# EAGLE schematic LPC1114 -- Valdez Mutant v.03 (EAGLE 7.0.0)
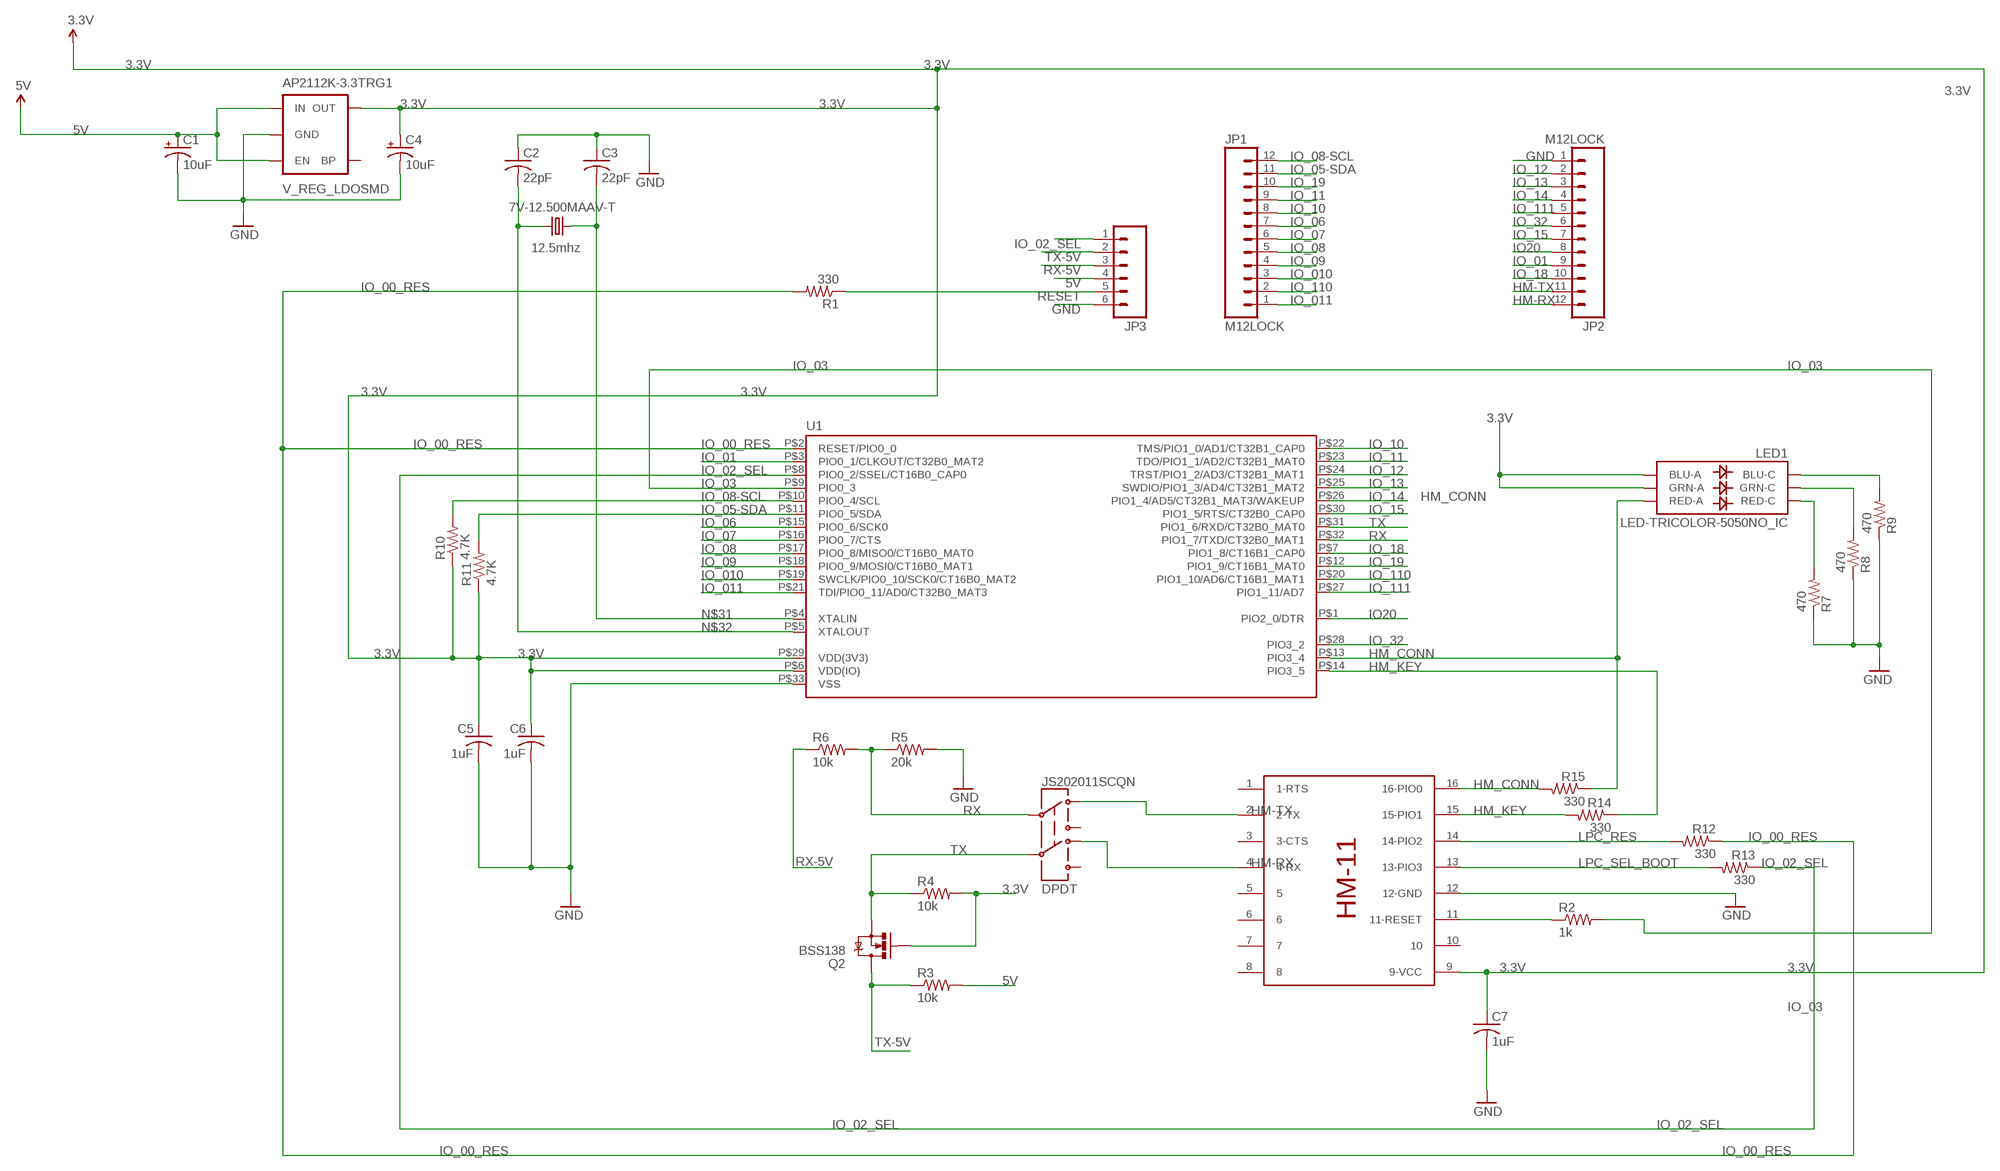
[diagram p0: schematic, sheet 1]

## Parts
7V-12.500MAAV-T  12.5mhz  CRYSTAL5X3  [CRYSTAL-SMD-5X3]
AP2112K-3.3TRG1  V_REG_LDOSMD  [SOT23-5]
C1  10uF  CAP_POL1206  [EIA3216]
C2  22pF  C-USC0402K  [C0402K]
C3  22pF  C-USC0402K  [C0402K]
C4  10uF  CAP_POL1206  [EIA3216]
C5  1uF  C-USC0402K  [C0402K]
C6  1uF  C-USC0402K  [C0402K]
C7  1uF  C-USC0402K  [C0402K]
JP1  M12LOCK  [1X12_LOCK]
JP2  M12LOCK  [1X12_LOCK]
JP3  M06LOCK  [1X06_LOCK]
JS202011SCQN  DPDT  SWITCH-DPDTAYZ0202  [AYZ0202]
LED1  LED-TRICOLOR-5050NO_IC  [LED-TRICOLOR-5050]
Q2  BSS138  MOSFET-NCHANNELBSS138  [SOT23]
R1  330  R-US_R0402  [R0402]
R2  1k  R-US_R0402  [R0402]
R3  10k  R-US_R0402  [R0402]
R4  10k  R-US_R0402  [R0402]
R5  20k  R-US_R0402  [R0402]
R6  10k  R-US_R0402  [R0402]
R7  470  R-US_R0402  [R0402]
R8  470  R-US_R0402  [R0402]
R9  470  R-US_R0402  [R0402]
R10  4.7K  R-US_R0402  [R0402]
R11  4.7K  R-US_R0402  [R0402]
R12  330  R-US_R0402  [R0402]
R13  330  R-US_R0402  [R0402]
R14  330  R-US_R0402  [R0402]
R15  330  R-US_R0402  [R0402]
U1  LPC1113/4_QFN  [HVQFN33-7X7]
U$1  HM-11  [HM-11]

## Nets
3.3V: AP2112K-3.3TRG1.5(OUT) C4.A(+) C5.1 C6.1 C7.1 LED1.1(GRN-A) LED1.3(BLU-A) Q2.1(G) R4.2 R10.1 R11.1 U1.P$6(VDD(IO)) U1.P$29(VDD(3V3)) U$1.9(9-VCC)
5V: AP2112K-3.3TRG1.1(IN) AP2112K-3.3TRG1.3(EN) C1.A(+) JP3.4 R3.2
CONN: R15.2 U$1.16(16-PIO0)
GND: AP2112K-3.3TRG1.2(GND) C1.C(-) C2.1 C3.1 C4.C(-) C5.2 C6.2 C7.2 JP2.1 JP3.6 R5.2 R7.1 R8.1 R9.1 U1.P$33(VSS) U$1.12(12-GND)
HM-RX: JP2.12 JS202011SCQN.4 U$1.4(4-RX)
HM-TX: JP2.11 JS202011SCQN.1 U$1.2(2-TX)
HM_CONN: LED1.2(RED-A) R15.1 U1.P$13(PIO3_4)
HM_KEY: R14.1 U1.P$14(PIO3_5)
IO20: JP2.8 U1.P$1(PIO2_0/DTR)
IO_00_RES: R1.2 R12.1 U1.P$2(RESET/PIO0_0)
IO_01: JP2.9 U1.P$3(PIO0_1/CLKOUT/CT32B0_MAT2)
IO_02_SEL: JP3.1 R13.1 U1.P$8(PIO0_2/SSEL/CT16B0_CAP0)
IO_03: R2.2 U1.P$9(PIO0_3)
IO_05-SDA: JP1.11 R11.2 U1.P$11(PIO0_5/SDA)
IO_06: JP1.7 U1.P$15(PIO0_6/SCK0)
IO_07: JP1.6 U1.P$16(PIO0_7/CTS)
IO_08: JP1.5 U1.P$17(PIO0_8/MISO0/CT16B0_MAT0)
IO_08-SCL: JP1.12 R10.2 U1.P$10(PIO0_4/SCL)
IO_09: JP1.4 U1.P$18(PIO0_9/MOSI0/CT16B0_MAT1)
IO_10: JP1.8 U1.P$22(TMS/PIO1_0/AD1/CT32B1_CAP0)
IO_010: JP1.3 U1.P$19(SWCLK/PIO0_10/SCK0/CT16B0_MAT2)
IO_11: JP1.9 U1.P$23(TDO/PIO1_1/AD2/CT32B1_MAT0)
IO_011: JP1.1 U1.P$21(TDI/PIO0_11/AD0/CT32B0_MAT3)
IO_12: JP2.2 U1.P$24(TRST/PIO1_2/AD3/CT32B1_MAT1)
IO_13: JP2.3 U1.P$25(SWDIO/PIO1_3/AD4/CT32B1_MAT2)
IO_14: JP2.4 U1.P$26(PIO1_4/AD5/CT32B1_MAT3/WAKEUP)
IO_15: JP2.7 U1.P$30(PIO1_5/RTS/CT32B0_CAP0)
IO_18: JP2.10 U1.P$7(PIO1_8/CT16B1_CAP0)
IO_19: JP1.10 U1.P$12(PIO1_9/CT16B1_MAT0)
IO_32: JP2.6 U1.P$28(PIO3_2)
IO_110: JP1.2 U1.P$20(PIO1_10/AD6/CT16B1_MAT1)
IO_111: JP2.5 U1.P$27(PIO1_11/AD7)
KEY: R14.2 U$1.15(15-PIO1)
LPC_RES: R12.2 U$1.14(14-PIO2)
LPC_SEL_BOOT: R13.2 U$1.13(13-PIO3)
N$2: LED1.4(BLU-C) R9.2
N$3: LED1.6(GRN-C) R8.2
N$4: LED1.5(RED-C) R7.2
N$9: R2.1 U$1.11(11-RESET)
N$31: 7V-12.500MAAV-T.3 C3.2 U1.P$4(XTALIN)
N$32: 7V-12.500MAAV-T.1 C2.2 U1.P$5(XTALOUT)
RESET: JP3.5 R1.1
RX: JS202011SCQN.2 R5.1 R6.2 U1.P$32(PIO1_7/TXD/CT32B0_MAT1)
RX-5V: JP3.3 R6.1
TX: JS202011SCQN.5 Q2.2(S) R4.1 U1.P$31(PIO1_6/RXD/CT32B0_MAT0)
TX-5V: JP3.2 Q2.3(D) R3.1
Unconnected: AP2112K-3.3TRG1.4(BP) JS202011SCQN.3 JS202011SCQN.6 U$1.1(1-RTS) U$1.3(3-CTS) U$1.5 U$1.6 U$1.7 U$1.8 U$1.10

## Library data of the parts
7V-12.500MAAV-T = SparkFun-FreqCtrl:CRYSTAL: Various standard crystals. Proven footprints. Spark Fun Electronics SKU : COM-00534
AP2112K-3.3TRG1 = SparkFun-PowerIC:V_REG_LDO: Voltage Regulator LDO Standard 150mA LDO voltage regulator in SOT-23 layout. Micrel part MIC5205. BP (by-pass) pin is used to lower output noise with 470pF cap.
C1 C4 = SparkFun-Capacitors:CAP_POL: Capacitor Polarized These are standard SMD and PTH capacitors. Normally 10uF, 47uF, and 100uF in electrolytic and tantalum varieties. Always verify the external diameter of the through hole cap, it varies with capacity, voltage, and manufacturer. The EIA devices should be standard.
C2 C3 C5-C7 = resistor:C-US: CAPACITOR, American symbol
JP1 JP2 = SparkFun-Connectors:M12: Header 12 Standard 12-pin 0.1" header. Use with straight break away headers (SKU : PRT-00116), right angle break away headers (PRT-00553), swiss pins (PRT-00743), machine pins (PRT-00117), and female headers (PRT-00115).
JP3 = SparkFun-Connectors:M06: Header 6 Standard 6-pin 0.1" header. Use with straight break away headers (SKU : PRT-00116), right angle break away headers (PRT-00553), swiss pins (PRT-00743), machine pins (PRT-00117), and female headers (PRT-00115). Molex polarized connector foot print use with SKU : PRT-08094 with associated crimp pins and housings. NOTES ON THE VARIANTS LOCK and LOCK_LONGPADS... This footprint was designed to help hold the alignment of a through-hole component (i.e. 6-pin header) while soldering it into place. You may notice that each hole has been shifted either up or down by 0.005 of an inch from it's more standard position (which is a perfectly straight line). This slight alteration caused the pins (the squares in the middle) to touch the edges of the holes. Because they are alternating, it causes a "brace" to hold the component in place. 0.005 has proven to be the perfect amount of "off-center" position when using our standard breakaway headers. Although looks a little odd when you look at the bare footprint, once you have a header in there, the alteration is very hard to notice. Also,if you push a header all the way into place, it is covered up entirely on the bottom side. This idea of altering the position of holes to aid alignment will be further integrated into the Sparkfun Library for other footprints. It can help hold any component with 3 or more connection pins.
JS202011SCQN = SparkFun-Electromechanical:SWITCH-DPDT: DPDT Version of the COM-00597; PROD_ID: SWCH-08179
LED1 = SparkFun-LED:LED-TRICOLOR-5050
Q2 = SparkFun-DiscreteSemi:MOSFET-NCHANNEL: Common NMOSFET Parts MFG P/N Store ID Prod ID FDD8780 TRANS-09984 SI7820DN TRANS-11055 FDS6630A IC-08089 2N7002PW TRANS-11151 FQP30N06L COM-10213 TRANS-10060 BSS123LT1G TRANS-08345 BSS138 TRANS-00830 BS170 2N7000; PROD_ID: TRANS-00830
R1-R15 = resistor:R-US_: RESISTOR, American symbol
U1 = microbuilder:LPC1113/4_QFN: LPC1113/4 ARM Cortex-M0 processor, running at frequencies of up to 50 MHz. QFN 33 Pin Package; DIGIKEY#: 568-4948-ND; MANF: NXP; MANF#: LPC1114FHN33/301,5
U$1 = HM-11:HM-11